# Altium schematic sheet NO_Potentiostat.SchDoc
size A4
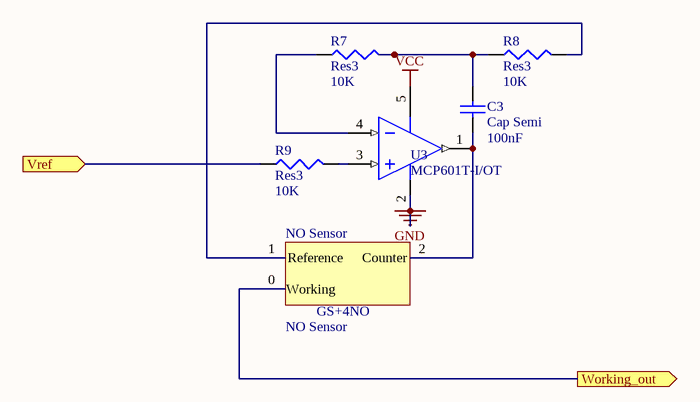
[diagram p0: NO_Potentiostat.SchDoc]

## Parts
C3  Cap Semi  value 100nF  [C1206]
NO_Sensor  NO Sensor  [NO_Sensor]
R7  Res3  value 10K  [J1-0603]
R8  Res3  value 10K  [J1-0603]
R9  Res3  value 10K  [J1-0603]
U3  MCP601T-I/OT  [SOT-23-OT5_L]

## Ports
Vref (in), Working_out (out)

## Nets
GND: U3.2(VSS)
VCC: U3.5(VDD)
Vref: R9.1 ; port Vref
Working_out: NO_Sensor.0(Working) ; port Working_out
NetC3_1: C3.1 NO_Sensor.2(Counter) U3.1(VOUT)
NetC3_2: C3.2 R7.2 R8.1
NetNO_Sensor_1: NO_Sensor.1(Reference) R8.2
NetR7_1: R7.1 U3.4(VIN-)
NetR9_2: R9.2 U3.3(VIN+)

## Library data of the parts
C3 = Cap Semi: Capacitor (Semiconductor SIM Model); Published: 8-Jun-2000; LatestRevisionDate: 29-May-2009; LatestRevisionNote: IPC-7351 Footprint Added.; PackageReference: C1206; Publisher: Altium Limited; PackageDescription: Chip Capacitor
NO_Sensor = GS+4NO
R7-R9 = Res3: Resistor; Published: 8-Jun-2000; LatestRevisionDate: 29-May-2009; LatestRevisionNote: IPC-7351 Footprint Added.; PackageReference: J1-0603; Publisher: Altium Limited; PackageDescription: Chip Resistor
U3 = CMP-0187-00433-2: 2.7V to 6.0V Single Supply CMOS Operational Amplifier, 5-Pin SOT-23, Industrial Temperature, Tape and Reel; Code_IPC: SOT23-5; ComponentLink3Description: Package Specification; RevisionNote: URLs added.; PackageReference: SOT-23-OT5; ComponentLink3URL: http://www.microchip.com/stellent/groups/techpub_sg/documents/packagingspec/en012702.pdf; ComponentLink1Description: Manufacturer URL; DatasheetVersion: revG, Dec-2007; PackageDescription: 5-Lead Plastic Small Outline Transistor (OT) [SOT-23]; PackageVersion: revBB, Aug-2009; ComponentLink2Description: Datasheet; ComponentLink1URL: http://www.microchip.com/; ComponentLink2URL: http://ww1.microchip.com/downloads/en/DeviceDoc/21314g.pdf